# EAGLE design Phaser Board (EAGLE 9.1.1)
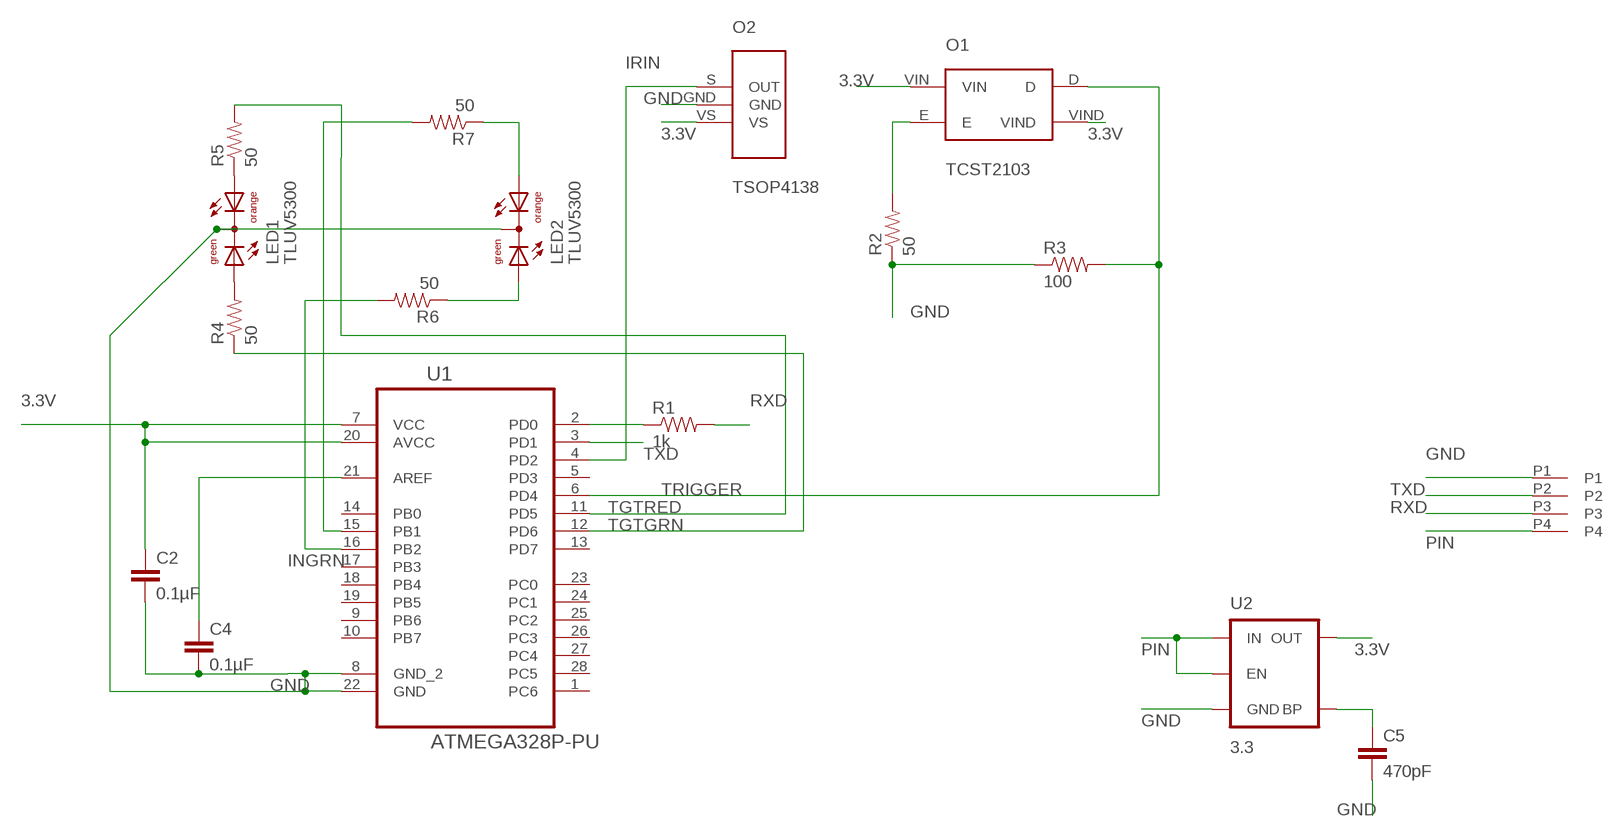
[diagram p0: schematic, sheet 1]

## Parts
C1  KK396-4  [KK396-4]
C2  0.1µF  CAP1206  [1206]
C4  0.1µF  CAP1206  [1206]
C5  470pF  CAP1206  [1206]
LED1  TLUV5300  [TLUV5300]
LED2  TLUV5300  [TLUV5300]
O1  TCST2103  [TCST2103]
O2  TSOP4138  [TSOP4138]
R1  1k  RESISTOR0603-RES  [0603-RES]
R2  50  RESISTOR0603-RES  [0603-RES]
R3  100  RESISTOR0603-RES  [0603-RES]
R4  50  RESISTOR0603-RES  [0603-RES]
R5  50  RESISTOR0603-RES  [0603-RES]
R6  50  RESISTOR0603-RES  [0603-RES]
R7  50  RESISTOR0603-RES  [0603-RES]
U1  ATMEGA328P-PU  [DIP254P762X457-28]
U2  3.3  MIC52053.3V  [SOT23-5]

## Nets
3.3V: C2.1 O1.VIN O1.VIND O2.VS U1.7(VCC) U1.20(AVCC) U2.5(OUT)
GND: C1.P1 C2.2 C4.2 C5.2 LED1.CC LED2.CC O2.GND R2.1 R3.1 U1.8(GND_2) U1.22(GND) U2.2(GND)
INGRN: R6.2 U1.16(PB2)
INRED: R7.2 U1.15(PB1)
IRIN: O2.S(OUT) U1.4(PD2)
N$1: R1.1 U1.2(PD0)
N$2: C4.1 U1.21(AREF)
N$3: C5.1 U2.4(BP)
N$4: LED1.AG R4.2
N$5: O1.E R2.2
N$6: LED1.AO R5.1
N$7: LED2.AO R7.1
N$8: LED2.AG R6.1
PIN: C1.P4 U2.1(IN) U2.3(EN)
RXD: C1.P3 R1.2
TGTGRN: R4.1 U1.12(PD6)
TGTRED: R5.2 U1.11(PD5)
TRIGGER: O1.D R3.2 U1.6(PD4)
TXD: C1.P2 U1.3(PD1)
Unconnected: U1.1(PC6) U1.5(PD3) U1.9(PB6) U1.10(PB7) U1.13(PD7) U1.14(PB0) U1.17(PB3) U1.18(PB4) U1.19(PB5) U1.23(PC0) U1.24(PC1) U1.25(PC2) U1.26(PC3) U1.27(PC4) U1.28(PC5)

## Library data of the parts
C1 = trigger:KK396-4
C2 C4 C5 = SparkFun-Passives:CAP: Capacitor Standard 0603 ceramic capacitor, and 0.1" leaded capacitor.
LED1 LED2 = led:TLUV5300: Bicolor LED 5 mm Untinted Diffused Package Source: www.vishay.com .. Bi-Color LED Vashay TLUV5300.pdf
O1 = trigger:TCST2103
O2 = trigger:TSOP4138
R1-R7 = SparkFun-Passives:RESISTOR: Resistor Basic schematic elements and footprints for 0603, 1206, and PTH resistors.
U1 = Atmel_By_element14_Batch_1-00:ATMEGA328P-PU: 8-bit Microcontroller with In-System Programmable Flash; MPN: ATMEGA328P-PU; OC_FARNELL: 1715487; OC_NEWARK: 15R0268; PACKAGE: PDIP-28; SPICEPREFIX: X; SUPPLIER: Atmel
U2 = SparkFun-PowerIC:MIC5205: MIC5205 150mA vreg 3.3V - VREG-00822 5V - VREG-00823; PROD_ID: VREG-00822

## Board
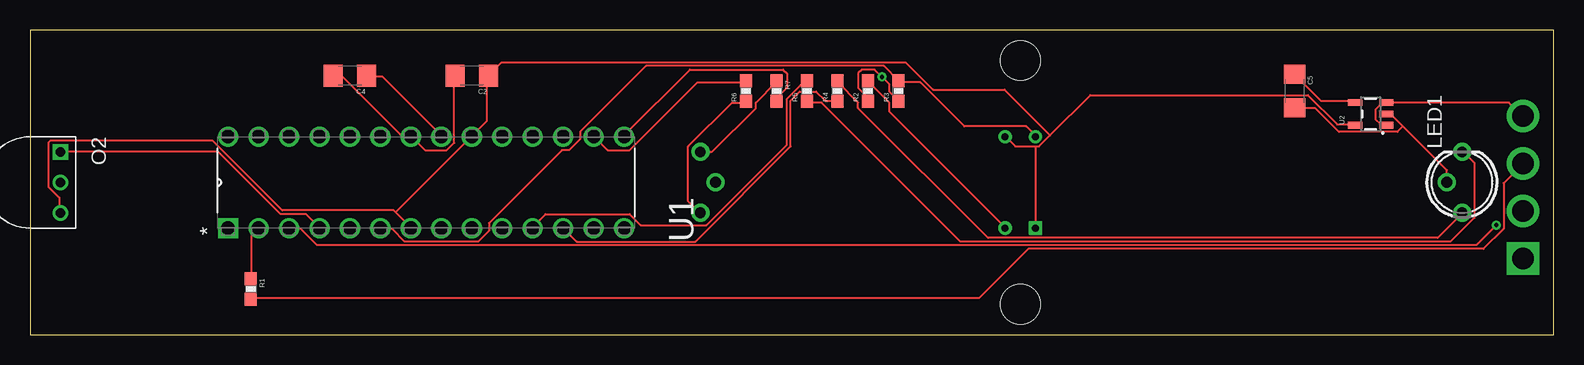
[diagram p1: board, top side]
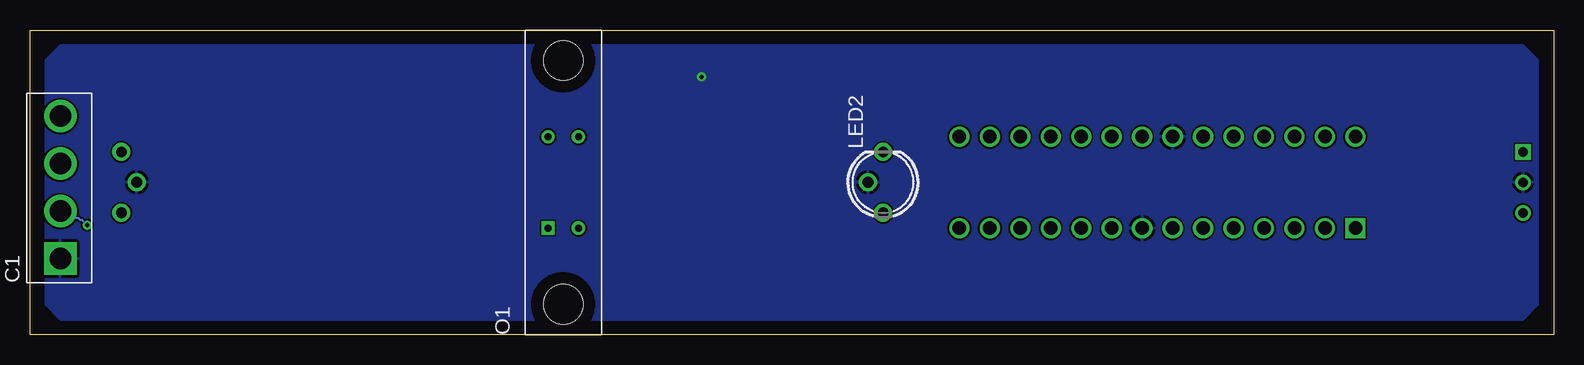
[diagram p2: board, bottom side, seen from below]

Size 127 x 25.4 mm. Coordinates in mm from the lower left corner, seen from the top.
Outline: 127,0 127,25.4 0,25.4 0,0 127,0
Copper layers (1*16): Top 0.035mm / dielectric 1.5mm / Bottom 0.035mm
Design rules "default": minimum track width 6mil, minimum drill 0.35mm, track to track 6mil, track to pad 6mil, pad to pad 6mil, via to via 6mil, smd to smd 6mil, copper to edge 40mil, drill to drill 6mil, minimum pad ring 10mil, minimum via ring 8mil, stop-mask expansion 4mil, vias tented up to drill 0mil, thermal gap 10mil

### Footprints (pad centres in the part's own frame; a part is rotated, then mirrored left to right if it is on the bottom)
KK396-4 = drill 1.8 square: P1 0,0 | drill 1.8: P2 3.96,0; P3 7.92,0; P4 11.88,0
1206 = smd 1.6 x 1.8: 1 -1.4,0; 2 1.4,0
TLUV5300 = drill 0.9 pad 1.5: AG 2.54,0; AO -2.54,0; CC 0,-1.27
TCST2103 = drill 0.6: D 16.51,-1.905; E 8.89,-4.445; VIND 16.51,-4.445 | drill 0.6 square: VIN 8.89,-1.905 | hole 3.3: 2.54,-3.175; 22.86,-3.175
TSOP4138 = drill 0.8: GND 0,0; VS 2.54,0 | drill 0.8 square: S -2.54,0
0603-RES = smd 1.1 x 1: 1 -0.85,0; 2 0.85,0
DIP254P762X457-28 = drill 1.118 square: 1 -7.62,33.02 | drill 1.118: 2 -7.62,30.48; 3 -7.62,27.94; 4 -7.62,25.4; 5 -7.62,22.86; 6 -7.62,20.32; 7 -7.62,17.78; 8 -7.62,15.24; 9 -7.62,12.7; 10 -7.62,10.16; 11 -7.62,7.62; 12 -7.62,5.08; 13 -7.62,2.54; 14 -7.62,0; 15 0,0; 16 0,2.54; 17 0,5.08; 18 0,7.62; 19 0,10.16; 20 0,12.7; 21 0,15.24; 22 0,17.78; 23 0,20.32; 24 0,22.86; 25 0,25.4; 26 0,27.94; 27 0,30.48; 28 0,33.02
SOT23-5 = smd 0.55 x 1.2: 1 -0.95,-1.3; 2 0,-1.3; 3 0.95,-1.3; 4 0.95,1.3; 5 -0.95,1.3

### Placement (x,y rotation side)
C1  124.46,6.35 90 bottom
C2  36.83,21.59 180 top
C4  26.67,21.59 180 top
C5  105.41,20.32 270 top
LED1  119.38,12.7 270 top
LED2  55.88,12.7 270 bottom
O1  85.72,0 90 bottom
O2  2.54,12.7 270 top
R1  18.41,3.81 270 top
R2  69.85,20.32 90 top
R3  72.39,20.32 90 top
R4  67.31,20.32 90 top
R5  64.77,20.32 90 top
R6  59.69,20.32 90 top
R7  62.23,20.32 270 top
U1  49.53,16.51 90 top
U2  111.76,18.41 90 top

### Tracks (layer width: path | path; a pad name or v marks a point on that pad's centre or on a via)
3.3V
  Top 0.152: 85.04,16.61 84.12,15.7 83.82,15.7 | 85.04,16.61 88.39,19.96 106.53,19.96 108.97,17.53 110.34,17.53 U2.5 | 83.82,15.7 82.14,15.7 81.38,16.46 O1.VIND | 83.82,15.7 83.82,8.99 O1.VIN | 30.48,10.21 31.7,8.99 U1.7 | 30.48,10.21 30.33,10.36 21.03,10.36 15.24,16.15 1.68,16.15 1.52,16 1.52,12.34 2.44,11.43 2.44,10.21 O2.VS | 30.48,10.21 36.73,16.46 U1.20 36.88,16.61 38.1,17.83 38.1,21.49 C2.1 38.25,21.64 39.32,22.71 73,22.71 75.29,20.42 81.23,20.42 85.04,16.61
GND  (via drill 0.35)
  Top 0.152: R2.1 69.8,19.51 69.8,19.81 69.04,20.57 69.04,21.79 69.34,22.1 70.41,22.1 v71.02,21.49 71.63,20.88 71.63,20.27 72.39,19.51 R3.1 | 114.45,17.37 118.11,13.72 118.11,12.8 LED1.CC | 114.45,17.37 113.54,18.29 113.08,18.29 U2.2 | 114.45,17.37 114,16.92 109.12,16.92 107.14,18.9 105.46,18.9 C5.2 | C4.2 25.3,21.49 26.06,21.49 30.94,16.61 31.7,16.61 U1.22 31.85,16.46 32.92,15.39 34.75,15.39 35.36,16 35.36,21.49 C2.2
  pour Bottom: 1.27,22.86 2.54,24.13 124.46,24.13 125.73,22.86 125.73,2.54 124.46,1.27 2.54,1.27 1.27,2.54
INGRN
  Top 0.152: R6.2 59.59,21.03 55.63,21.03 49.99,15.39 48.16,15.39 47.09,16.46 U1.16
INRED
  Top 0.152: R7.2 62.33,19.51 62.33,19.81 63.09,20.57 63.09,21.79 62.79,22.1 55.02,22.1 49.53,16.61 U1.15
IRIN
  Top 0.152: O2.S 2.59,15.24 15.7,15.24 20.88,10.06 23.01,10.06 24.08,8.99 U1.4
N$1
  Top 0.152: R1.1 18.44,4.72 18.44,8.23 19.05,8.84 U1.2
N$2
  Top 0.152: C4.1 28.19,21.49 29.41,21.49 34.29,16.61 U1.21
N$3
  Top 0.152: U2.4 110.34,19.51 107.59,19.51 105.46,21.64 C5.1
N$4
  Top 0.152: R4.2 67.36,21.03 69.04,19.36 69.04,18.9 79.86,8.08 117.35,8.08 119.33,10.06 LED1.AG
N$5
  Top 0.152: R2.2 69.95,21.03 71.63,19.36 71.63,18.59 81.23,8.99 O1.E
N$6
  Top 0.152: R5.1 64.77,19.36 65.99,19.36 77.57,7.77 118.42,7.77 120.4,9.75 120.4,14.33 119.48,15.24 LED1.AO
N$7
  Top 0.152: R7.1 62.18,21.03 60.5,19.36 60.5,18.9 56.84,15.24 55.93,15.24 LED2.AO
N$8
  Top 0.152: R6.1 59.59,19.36 58.52,19.36 54.86,15.7 54.86,11.12 55.78,10.21 LED2.AG
PIN
  Top 0.152: U2.1 112.93,17.53 112.62,17.53 112.17,17.98 112.17,18.75 112.93,19.51 U2.3 113.08,19.36 123.29,19.36 124.36,18.29 C1.P4
RXD
  Top 0.152: R1.2 18.44,3.05 79.1,3.05 83.21,7.16 121.16,7.16 122.83,8.84 122.83,12.65 124.36,14.17 C1.P3
TGTGRN
  Top 0.152: R4.1 67.21,19.51 66.29,19.51 65.53,20.27 64.16,20.27 63.4,19.51 63.4,15.7 55.47,7.77 45.57,7.77 44.5,8.84 U1.12
TGTRED
  Top 0.152: R5.2 64.77,21.03 64.47,21.03 63.09,19.66 63.09,15.85 56.39,9.14 50.9,9.14 49.99,10.06 42.98,10.06 41.91,8.99 U1.11
TRIGGER
  Top 0.152: O1.D 83.82,16.61 83.06,17.37 77.88,17.37 74.22,21.03 72.39,21.03 R3.2 72.39,21.18 71.17,22.4 51.36,22.4 45.87,16.92 45.87,16.31 44.96,15.39 44.35,15.39 38.25,9.3 38.25,8.69 37.34,7.77 31.24,7.77 30.18,8.84 29.26,8.84 U1.6
TXD  (via drill 0.35)
  Top 0.152: v122.22,9.14 120.55,7.47 23.93,7.47 22.55,8.84 21.64,8.84 U1.3
  Bottom 0.152: v122.22,9.14 122.68,9.6 122.83,9.6 122.99,9.75 123.14,9.75 123.6,10.21 124.36,10.21 C1.P2